# Altium schematic sheet ppp.SchDoc
size B; PageSetup: Record=PageOptions|CenterHorizontal=True|CenterVertical=True|PrintScale=0.75|XCorrection=1.00|YCorrection=1.00|PrintKind=0|BorderSize=5000000|LeftOffset=0|BottomOffset=0|Orientation=2|PaperLength=1000|PaperWidth=1000|Scale=100|PaperSource=7|PrintQuality=300|MediaType=1|DitherType=10|PaperKind=A4 (210 x 297mm)|PrintScaleMode=1
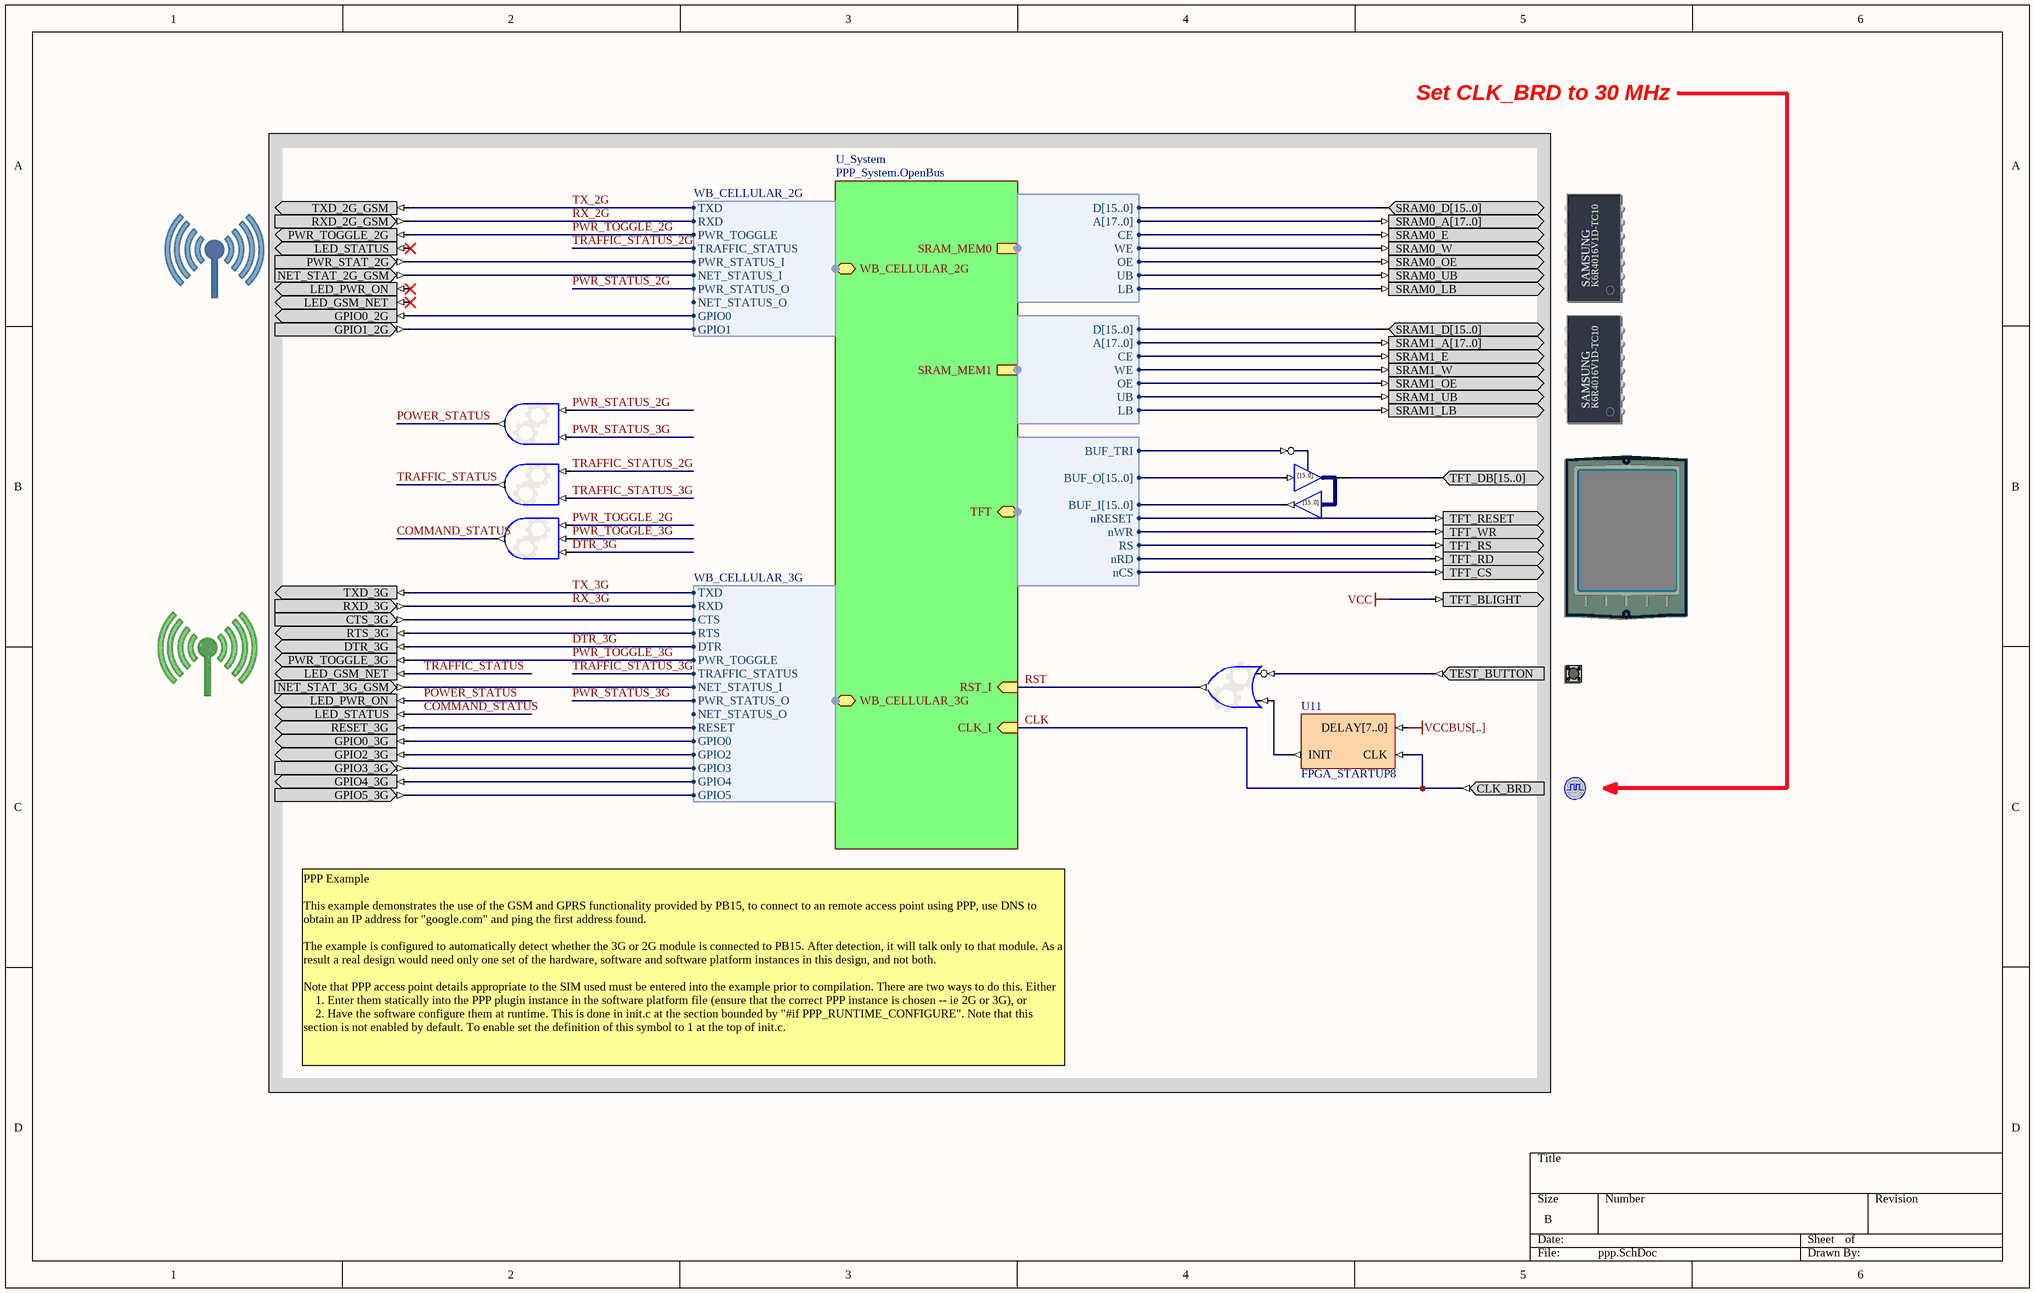
[diagram p0: ppp.SchDoc]

## Parts
(Parts that share a designator on the sheet are numbered #1, #2 ... from top to bottom, then left to right.)
*  3G_GSM_GPS_COMP  (value not drawn)
?#1  SRAM_DAUGHTER0  (value not drawn)
?#2  2G_GSM_COMP  (value not drawn)
?#3  SRAM_DAUGHTER1  (value not drawn)
?#4  TFT_LCD  (value not drawn)
?#5  TEST_BUTTON  (value not drawn)
?#6  CLOCK_BOARD  (value not drawn)
U4  IOBUF16B  (value not drawn)
U6  OR2S  (value not drawn)
U7  AND3S  (value not drawn)
U8  AND2S  (value not drawn)
U9  AND2S  (value not drawn)
U11  FPGA_STARTUP8

## Sub-sheets
U_System = PPP_System.OpenBus: SRAM_MEM0 (harness WB_MEM_CTRL_SRAM16_A18), SRAM_MEM1 (harness WB_MEM_CTRL_SRAM16_A18), RST_I (in), CLK_I (in), TFT (harness VGA32_ILI9320), WB_CELLULAR_2G (harness WB_CELLULAR_2G), WB_CELLULAR_3G (harness WB_CELLULAR_3G)

## Harnesses
WB_MEM_CTRL_SRAM16_A18: D[15..0], A[17..0], CE, WE, OE, UB, LB
VGA32_ILI9320: BUF_TRI, BUF_O[15..0], BUF_I[15..0], nRESET, nWR, RS, nRD, nCS
WB_CELLULAR_2G: TXD, RXD, PWR_TOGGLE, TRAFFIC_STATUS, PWR_STATUS_I, NET_STATUS_I, PWR_STATUS_O, NET_STATUS_O, GPIO0, GPIO1
WB_CELLULAR_3G: TXD, RXD, CTS, RTS, DTR, PWR_TOGGLE, TRAFFIC_STATUS, NET_STATUS_I, PWR_STATUS_O, NET_STATUS_O, RESET, GPIO0, GPIO2, GPIO3, GPIO4, GPIO5

## Nets
VCC: ?#4.TFT_BLIGHT
VCCBUS[..]: U11.DELAY[7..0]
CLK: ?#6.CLK_BRD U11.CLK ; sheet U_System/CLK_I
COMMAND_STATUS: *.LED_STATUS U7.O
DTR_3G: *.DTR_3G U7.I2 ; sheet U_System/WB_CELLULAR_3G.DTR
POWER_STATUS: *.LED_PWR_ON U9.O
PWR_STATUS_2G: U9.I0 ; sheet U_System/WB_CELLULAR_2G.PWR_STATUS_O
PWR_STATUS_3G: U9.I1 ; sheet U_System/WB_CELLULAR_3G.PWR_STATUS_O
PWR_TOGGLE_2G: ?#2.PWR_TOGGLE_2G U7.I0 ; sheet U_System/WB_CELLULAR_2G.PWR_TOGGLE
PWR_TOGGLE_3G: *.PWR_TOGGLE_3G U7.I1 ; sheet U_System/WB_CELLULAR_3G.PWR_TOGGLE
RST: U6.O ; sheet U_System/RST_I
RX_2G: ?#2.RXD_2G_GSM ; sheet U_System/WB_CELLULAR_2G.RXD
RX_3G: *.RXD_3G ; sheet U_System/WB_CELLULAR_3G.RXD
TRAFFIC_STATUS: *.LED_GSM_NET U8.O
TRAFFIC_STATUS_2G: U8.I0 ; sheet U_System/WB_CELLULAR_2G.TRAFFIC_STATUS
TRAFFIC_STATUS_3G: U8.I1 ; sheet U_System/WB_CELLULAR_3G.TRAFFIC_STATUS
TX_2G: ?#2.TXD_2G_GSM ; sheet U_System/WB_CELLULAR_2G.TXD
TX_3G: *.TXD_3G ; sheet U_System/WB_CELLULAR_3G.TXD
Net*_CTS_3G: *.CTS_3G ; sheet U_System/WB_CELLULAR_3G.CTS
Net*_GPIO0_3G: *.GPIO0_3G ; sheet U_System/WB_CELLULAR_3G.GPIO0
Net*_GPIO2_3G: *.GPIO2_3G ; sheet U_System/WB_CELLULAR_3G.GPIO2
Net*_GPIO3_3G: *.GPIO3_3G ; sheet U_System/WB_CELLULAR_3G.GPIO3
Net*_GPIO4_3G: *.GPIO4_3G ; sheet U_System/WB_CELLULAR_3G.GPIO4
Net*_GPIO5_3G: *.GPIO5_3G ; sheet U_System/WB_CELLULAR_3G.GPIO5
Net*_NET_STAT_3G_GSM: *.NET_STAT_3G_GSM ; sheet U_System/WB_CELLULAR_3G.NET_STATUS_I
Net*_RESET_3G: *.RESET_3G ; sheet U_System/WB_CELLULAR_3G.RESET
Net*_RTS_3G: *.RTS_3G ; sheet U_System/WB_CELLULAR_3G.RTS
Net?#1_SRAM0_A[17..0]: ?#1.SRAM0_A[17..0] ; sheet U_System/SRAM_MEM0.A[17..0]
Net?#1_SRAM0_D[15..0]: ?#1.SRAM0_D[15..0] ; sheet U_System/SRAM_MEM0.D[15..0]
Net?#1_SRAM0_E: ?#1.SRAM0_E ; sheet U_System/SRAM_MEM0.CE
Net?#1_SRAM0_LB: ?#1.SRAM0_LB ; sheet U_System/SRAM_MEM0.LB
Net?#1_SRAM0_OE: ?#1.SRAM0_OE ; sheet U_System/SRAM_MEM0.OE
Net?#1_SRAM0_UB: ?#1.SRAM0_UB ; sheet U_System/SRAM_MEM0.UB
Net?#1_SRAM0_W: ?#1.SRAM0_W ; sheet U_System/SRAM_MEM0.WE
Net?#2_GPIO0_2G: ?#2.GPIO0_2G ; sheet U_System/WB_CELLULAR_2G.GPIO0
Net?#2_GPIO1_2G: ?#2.GPIO1_2G ; sheet U_System/WB_CELLULAR_2G.GPIO1
Net?#2_NET_STAT_2G_GSM: ?#2.NET_STAT_2G_GSM ; sheet U_System/WB_CELLULAR_2G.NET_STATUS_I
Net?#2_PWR_STAT_2G: ?#2.PWR_STAT_2G ; sheet U_System/WB_CELLULAR_2G.PWR_STATUS_I
Net?#3_SRAM1_A[17..0]: ?#3.SRAM1_A[17..0] ; sheet U_System/SRAM_MEM1.A[17..0]
Net?#3_SRAM1_D[15..0]: ?#3.SRAM1_D[15..0] ; sheet U_System/SRAM_MEM1.D[15..0]
Net?#3_SRAM1_E: ?#3.SRAM1_E ; sheet U_System/SRAM_MEM1.CE
Net?#3_SRAM1_LB: ?#3.SRAM1_LB ; sheet U_System/SRAM_MEM1.LB
Net?#3_SRAM1_OE: ?#3.SRAM1_OE ; sheet U_System/SRAM_MEM1.OE
Net?#3_SRAM1_UB: ?#3.SRAM1_UB ; sheet U_System/SRAM_MEM1.UB
Net?#3_SRAM1_W: ?#3.SRAM1_W ; sheet U_System/SRAM_MEM1.WE
Net?#4_TFT_CS: ?#4.TFT_CS ; sheet U_System/TFT.nCS
Net?#4_TFT_DB[15..0]: ?#4.TFT_DB[15..0] U4.IO[15..0]
Net?#4_TFT_RD: ?#4.TFT_RD ; sheet U_System/TFT.nRD
Net?#4_TFT_RESET: ?#4.TFT_RESET ; sheet U_System/TFT.nRESET
Net?#4_TFT_RS: ?#4.TFT_RS ; sheet U_System/TFT.RS
Net?#4_TFT_WR: ?#4.TFT_WR ; sheet U_System/TFT.nWR
Net?#5_TEST_BUTTON: ?#5.TEST_BUTTON U6.I0
NetU4_I[15..0]: U4.I[15..0] ; sheet U_System/TFT.BUF_O[15..0]
NetU4_O[15..0]: U4.O[15..0] ; sheet U_System/TFT.BUF_I[15..0]
NetU4_T: U4.T ; sheet U_System/TFT.BUF_TRI
NetU6_I1: U6.I1 U11.INIT

Not connected (* = marked no-connect by the designer): ?#2 LED_GSM_NET* LED_PWR_ON* LED_STATUS*

## Notes on the sheet
- Set CLK_BRD to 30 MHz
- PPP Example
  This example demonstrates the use of the GSM and GPRS functionality provided by PB15, to connect to an remote access point using PPP, use DNS to obtain an IP address for "google.com" and ping the first address found.
  The example is configured to automatically detect whether the 3G or 2G module is connected to PB15. After detection, it will talk only to that module. As a result a real design would need only one set of the hardware, software and software platform instances in this design, and not both.
  Note that PPP access point details appropriate to the SIM used must be entered into the example prior to compilation. There are two ways to do this. Either
  1. Enter them statically into the PPP plugin instance in the software platform file (ensure that the correct PPP instance is chosen -- ie 2G or 3G), or
  2. Have the software configure them at runtime. This is done in init.c at the section bounded by "#if PPP_RUNTIME_CONFIGURE". Note that this section is not enabled by default. To enable set the definition of this symbol to 1 at the top of init.c.
- (in symbol IOBUF16B) [15..0]
- (in symbol SRAM_DAUGHTER0) SAMSUNG; K6R4016V1D-TC10
- (in symbol SRAM_DAUGHTER1) SAMSUNG; K6R4016V1D-TC10

## Library data of the parts
* = 3G_GSM_GPS_COMP: 3G GSM/GPRS/GPS Component; PortComponent: TRUE
?#1 = SRAM_DAUGHTER0: Free Static RAM - Daughterboard; PortComponent: True; Published: 14-May-2007; Publisher: Altium Limited; HelpURL: TR0149 Technical Reference for Altium's Xilinx Spartan-3 Daughter Board DB30.pdf#page=16
?#2 = 2G_GSM_COMP: 2G GSM/GPRS Component; PortComponent: True; Published: 22-Jan-2007; Publisher: Altium Limited; HelpURL: https://wiki.altium.com/display/ADOH/PB03+Resources+-+Ethernet+Port
?#3 = SRAM_DAUGHTER1: Free Static RAM - Daughterboard; PortComponent: True; Published: 14-May-2007; Publisher: Altium Limited; HelpURL: TR0149 Technical Reference for Altium's Xilinx Spartan-3 Daughter Board DB30.pdf#page=16
?#4 = TFT_LCD: TFT LCD Panel; PortComponent: True; Published: 22-Jan-2007; Publisher: Altium Limited; HelpURL: https://wiki.altium.com/display/ADOH/NanoBoard+3000+-+TFT+LCD+Panel+%28with+Touch+Screen%29
?#5 = TEST_BUTTON: Test / Reset Button; PortComponent: True; Published: 19-Nov-2003; Publisher: Altium Limited; HelpURL: TR0143 Technical Reference Manual for Altium's Desktop NanoBoard NB2DSK01.pdf#page=53
?#6 = CLOCK_BOARD: Global System Clock Supply; PortComponent: True; Published: 19-Nov-2003; Publisher: Altium Limited; HelpURL: TR0143 Technical Reference Manual for Altium's Desktop NanoBoard NB2DSK01.pdf#page=41; UseInDSF: True
U4 = IOBUF16B: 16-Bit Input/Output Buffer, Bus Version; SubClass: IOBUF; Enable: Low; Control: Common Control T; PortSize: 16; ArchiveName: GENERIC; VHDLIB_SIM: GENERIC_LIB; Published: 29-Jan-2004; Publisher: Altium Limited; LastRevisionNo: 1.00.00; HelpURL: CR0118 FPGA Generic Library Guide.pdf#page=293; ComponentLink1URL: CR0125 FPGA Buffer Resource Usage.pdf#page=91; ComponentLink1Description: Core &Resource Usage; FunctionalClass: Buffer; PortStyle: Bus Version
U6 = GATE: Configurable Generic Gate; ConfiguratorName: GENERIC_GATE; ConfigurationParameters: {}Version[1.0]{}GateKind[OR]{}BusInput[False]{}GateInputType[Bit]{}GateOutputOption[Normal]{}BusWidth[8]{}RegisterOutputs[False]{}NegativeClockEdge[False]{}InputCount[2]{}InputInvert0[True]{}InputInvert1[False]{}; LastRevisionNo: 1.00.00; Published: 3-Sep-2008; Publisher: Altium Limited
U7 = GATE: Configurable Generic Gate; ConfiguratorName: GENERIC_GATE; ConfigurationParameters: {}Version[1.1]{}GateKind[AND]{}BusInput[False]{}GateInputType[Bit]{}GateOutputOption[Normal]{}BusWidth[8]{}RegisterOutputs[False]{}NegativeClockEdge[False]{}InputCount[3]{}InputInvert0[False]{}InputInvert1[False]{}InputInvert2[False]{}; LastRevisionNo: 1.00.00; Published: 3-Sep-2008; Publisher: Altium Limited; HelpURL: https://wiki.altium.com/display/ADOH/Configurable+Generic+Library
U8 U9 = GATE: Configurable Generic Gate; ConfiguratorName: GENERIC_GATE; ConfigurationParameters: {}Version[1.1]{}GateKind[AND]{}BusInput[False]{}GateInputType[Bit]{}GateOutputOption[Normal]{}BusWidth[8]{}RegisterOutputs[False]{}NegativeClockEdge[False]{}InputCount[2]{}InputInvert0[False]{}InputInvert1[False]{}; LastRevisionNo: 1.00.00; Published: 3-Sep-2008; Publisher: Altium Limited; HelpURL: https://wiki.altium.com/display/ADOH/Configurable+Generic+Library
U11 = FPGA_STARTUP8: FPGA Startup With 8 Bit Delay; Published: 9-Dec-2004; Publisher: Altium Limited; HelpURL: CR0119 FPGA_STARTUPx Powerup Delay Unit.pdf; LastRevisionNo: 1.00.00; ComponentLink1Description: Core &Resource Usage; ComponentLink1URL: CR0139 FPGA Peripheral Resource Usage.pdf#page=11